# EAGLE design PCB Plates Combined Eagle (EAGLE 9.6.2)
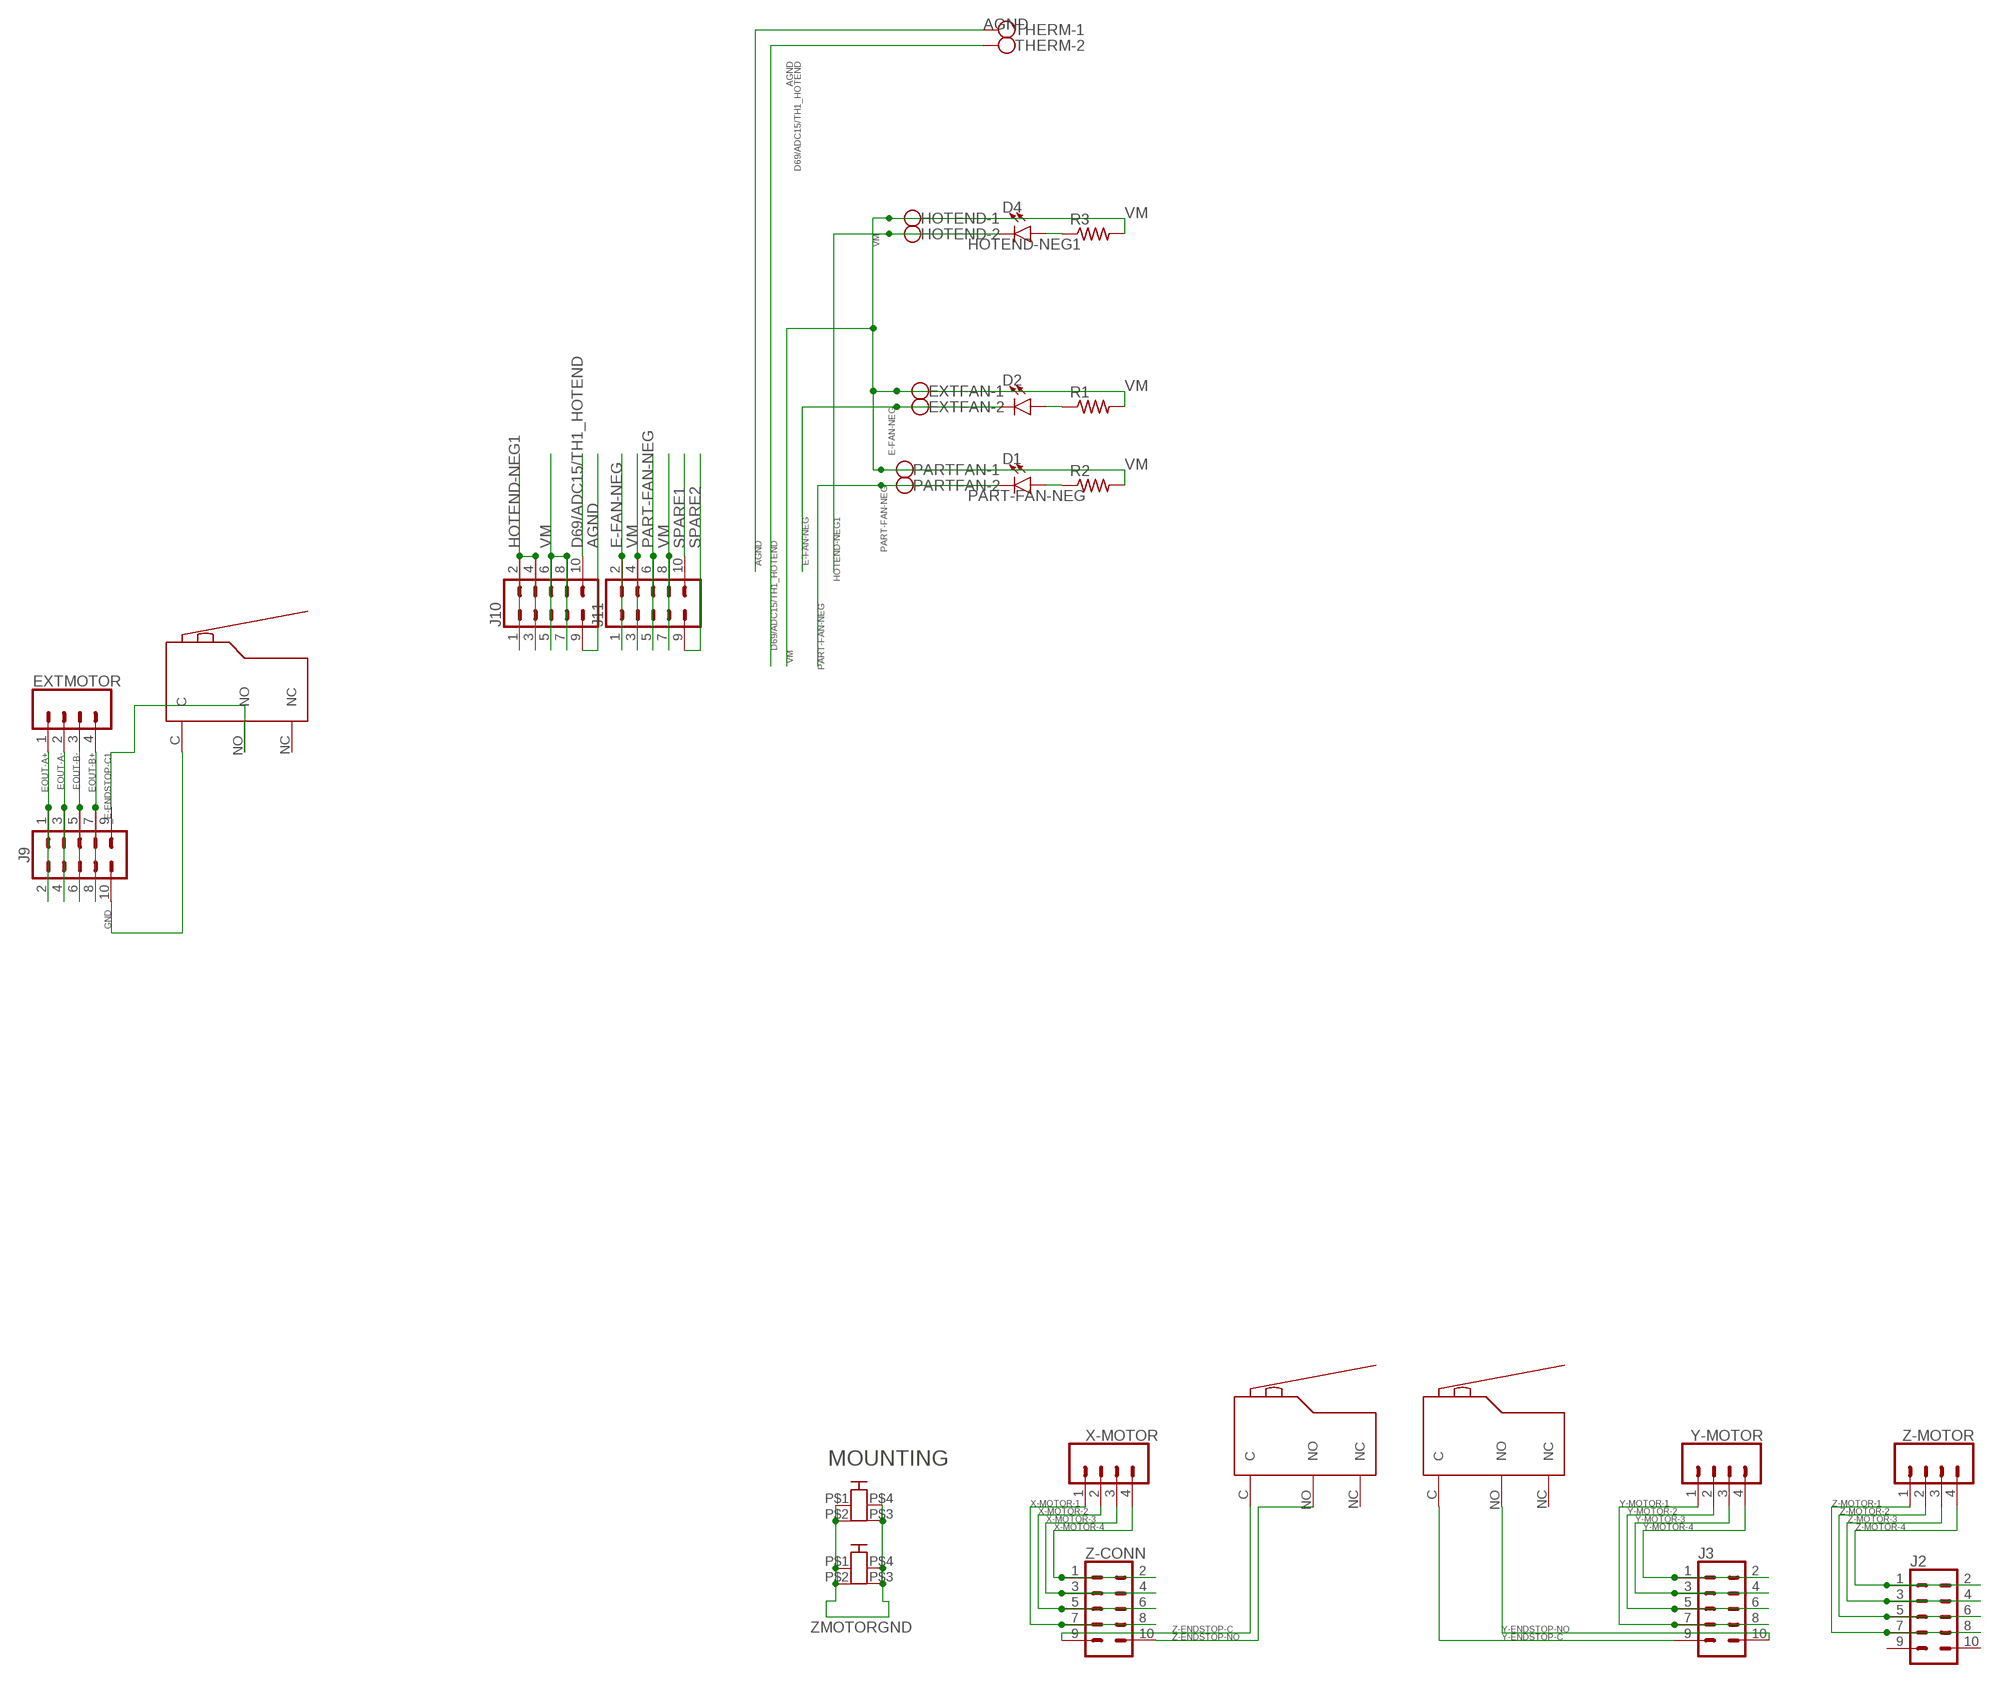
[diagram p0: schematic, sheet 1]

## Parts
CON1  PCB-2M3  [PCB2-M3]
CON7  PCB-2M3  [PCB2-M3]
D1  LED-FKIT-1206  [FKIT-LED-1206]
D2  LED-FKIT-1206  [FKIT-LED-1206]
D4  LED-FKIT-1206  [FKIT-LED-1206]
EXTFAN  W237-102  [W237-102]
EXTMOTOR  CONN_04SCREW_LOCK  [SCREWTERMINAL-3.5MM-4_LOCK]
HOTEND  W237-102  [W237-102]
J2  CONN_05X2SHD_LOCK  [2X5-SHROUDED_LOCK]
J3  CONN_05X2SHD_LOCK  [2X5-SHROUDED_LOCK]
J9  CONN_05X2SHD_LOCK  [2X5-SHROUDED_LOCK]
J10  CONN_05X2SHD_LOCK  [2X5-SHROUDED_LOCK]
J11  CONN_05X2SHD_LOCK  [2X5-SHROUDED_LOCK]
PARTFAN  W237-102  [W237-102]
R1  R-US_R1206  [R1206]
R2  R-US_R1206  [R1206]
R3  R-US_R1206  [R1206]
THERM  W237-102  [W237-102]
U$1  Lever Microswitch Leftangle PCB mount, with Roller style lever, with a red roller  LEVERMICROPCBLEFTANGLE  [LEVERMICROPCB-LEFTANGLE]
X-MOTOR  CONN_04SCREW_LOCK  [SCREWTERMINAL-3.5MM-4_LOCK]
XENDSTOP  Lever Microswitch Leftangle PCB mount, with Roller style lever, with a red roller  LEVERMICROPCBLEFTANGLE  [LEVERMICROPCB-LEFTANGLE]
Y-MOTOR  CONN_04SCREW_LOCK  [SCREWTERMINAL-3.5MM-4_LOCK]
Z-CONN  CONN_05X2SHD_LOCK  [2X5-SHROUDED_LOCK]
Z-MOTOR  CONN_04SCREW_LOCK  [SCREWTERMINAL-3.5MM-4_LOCK]
ZENDSTOP  Lever Microswitch Leftangle PCB mount, with Roller style lever, with a red roller  LEVERMICROPCBLEFTANGLE  [LEVERMICROPCB-LEFTANGLE]

## Nets
_E-ENDSTOP-C1: J9.9 XENDSTOP.NO
AGND: J10.9 THERM.1
D69/ADC15/TH1_HOTEND: J10.10 THERM.2
E-FAN-NEG: D2.C EXTFAN.2 J11.1 J11.2
EOUT-A+: EXTMOTOR.1 J9.1 J9.2
EOUT-A-: EXTMOTOR.2 J9.3 J9.4
EOUT-B+: EXTMOTOR.4 J9.7 J9.8
EOUT-B-: EXTMOTOR.3 J9.5 J9.6
GND: J9.10 XENDSTOP.C
HOTEND-NEG1: D4.C HOTEND.2 J10.1 J10.2 J10.3 J10.4
N$12: D2.A R1.1
N$48: D1.A R2.1
N$49: D4.A R3.1
PART-FAN-NEG: D1.C J11.5 J11.6 PARTFAN.2
SPARE1: J11.10
SPARE2: J11.9
VM: EXTFAN.1 HOTEND.1 J10.5 J10.6 J10.7 J10.8 J11.3 J11.4 J11.7 J11.8 PARTFAN.1 R1.2 R2.2 R3.2
X-MOTOR-1: X-MOTOR.1 Z-CONN.7 Z-CONN.8
X-MOTOR-2: X-MOTOR.2 Z-CONN.5 Z-CONN.6
X-MOTOR-3: X-MOTOR.3 Z-CONN.3 Z-CONN.4
X-MOTOR-4: X-MOTOR.4 Z-CONN.1 Z-CONN.2
Y-ENDSTOP-C: J3.9 U$1.C
Y-ENDSTOP-NO: J3.10 U$1.NO
Y-MOTOR-1: J3.7 J3.8 Y-MOTOR.1
Y-MOTOR-2: J3.5 J3.6 Y-MOTOR.2
Y-MOTOR-3: J3.3 J3.4 Y-MOTOR.3
Y-MOTOR-4: J3.1 J3.2 Y-MOTOR.4
Z-ENDSTOP-C: Z-CONN.9 ZENDSTOP.C
Z-ENDSTOP-NO: Z-CONN.10 ZENDSTOP.NO
Z-MOTOR-1: J2.7 J2.8 Z-MOTOR.1
Z-MOTOR-2: J2.5 J2.6 Z-MOTOR.2
Z-MOTOR-3: J2.3 J2.4 Z-MOTOR.3
Z-MOTOR-4: J2.1 J2.2 Z-MOTOR.4
ZMOTORGND: CON1.P$1 CON1.P$2 CON1.P$3 CON1.P$4 CON7.P$1 CON7.P$2 CON7.P$3 CON7.P$4
Unconnected: J2.9 J2.10 U$1.NC XENDSTOP.NC ZENDSTOP.NC

## Notes on the sheet
- MOUNTING

## Library data of the parts
CON1 CON7 = Screw Terminals:PCB-2M3
D1 D2 D4 = SparkFun-LED:LED: LED (Generic) Standard schematic elements and footprints for 5mm, 3mm, 1206, and 0603 sized LEDs. Generic LEDs with no color specified.
EXTFAN HOTEND PARTFAN THERM = con-wago-500:W237-102: WAGO SCREW CLAMP; MPN: 237-102; OC_FARNELL: unknown; OC_NEWARK: 70K9898
EXTMOTOR X-MOTOR Y-MOTOR Z-MOTOR = SparkFun-Connectors:CONN_04: Multi connection point. Often used as Generic Header-pin footprint for 0.1 inch spaced/style header connections On any of the 0.1 inch spaced packages, you can populate with these: Break Away Headers - Straight (PRT-00116) Break Away Male Headers - Right Angle (PRT-00553) Female Headers (PRT-00115) Break Away Headers - Machine Pin (PRT-00117) Break Away Female Headers - Swiss Machine Pin (PRT-00743) For SCREWTERMINALS and SPRING TERMINALS visit here: Screw Terimnals on SparkFun.com (5mm/3.5mm/2.54mm spacing) This device is also useful as a general connection point to wire up your design to another part of your project. Our various solder wires solder well into these plated through hole pads. Hook-Up Wire - Assortment (Stranded, 22 AWG) (PRT-11375) Hook-Up Wire - Assortment (Solid Core, 22 AWG) (PRT-11367) View the entire wire category on our website here Special notes: Molex polarized connector foot print use with SKU : PRT-08231 with associated crimp pins and housings. 1MM SMD Version SKU: PRT-10208
J2 J3 J9-J11 Z-CONN = SparkFun-Connectors:CONN_05X2: Multi connection point. Often used as Generic Header-pin footprint for 0.1 inch spaced/style header connections For AVR SPI programming port, see special device with nice symbol: "AVR_SPI_PROG_5x2.dev" You can populate with any combo of single row headers, but if you'd like an exact match, check these: 2x5 AVR ICSP Male Header (PRT-00778) 2x5 Pin Shrouded Header (PRT-08506) On any of the 0.1 inch spaced packages, you can populate with these: Break Away Headers - Straight (PRT-00116) Break Away Male Headers - Right Angle (PRT-00553) Female Headers (PRT-00115) Break Away Headers - Machine Pin (PRT-00117) Break Away Female Headers - Swiss Machine Pin (PRT-00743) Special note: the shrouded connector mates well with our 5x2 ribbon cables: 2x5 Pin IDC Ribbon Cable (PRT-08535); PROD_ID: CONN-08671; SF_ID: PRT-08506
R1-R3 = rcl:R-US_: RESISTOR, American symbol; SPICEPREFIX: R
U$1 XENDSTOP ZENDSTOP = Lever Microswitch Right Angle:LEVERMICROPCB

## Net classes
0 default: width 0.203 mm, clearance 0.152 mm

## Board
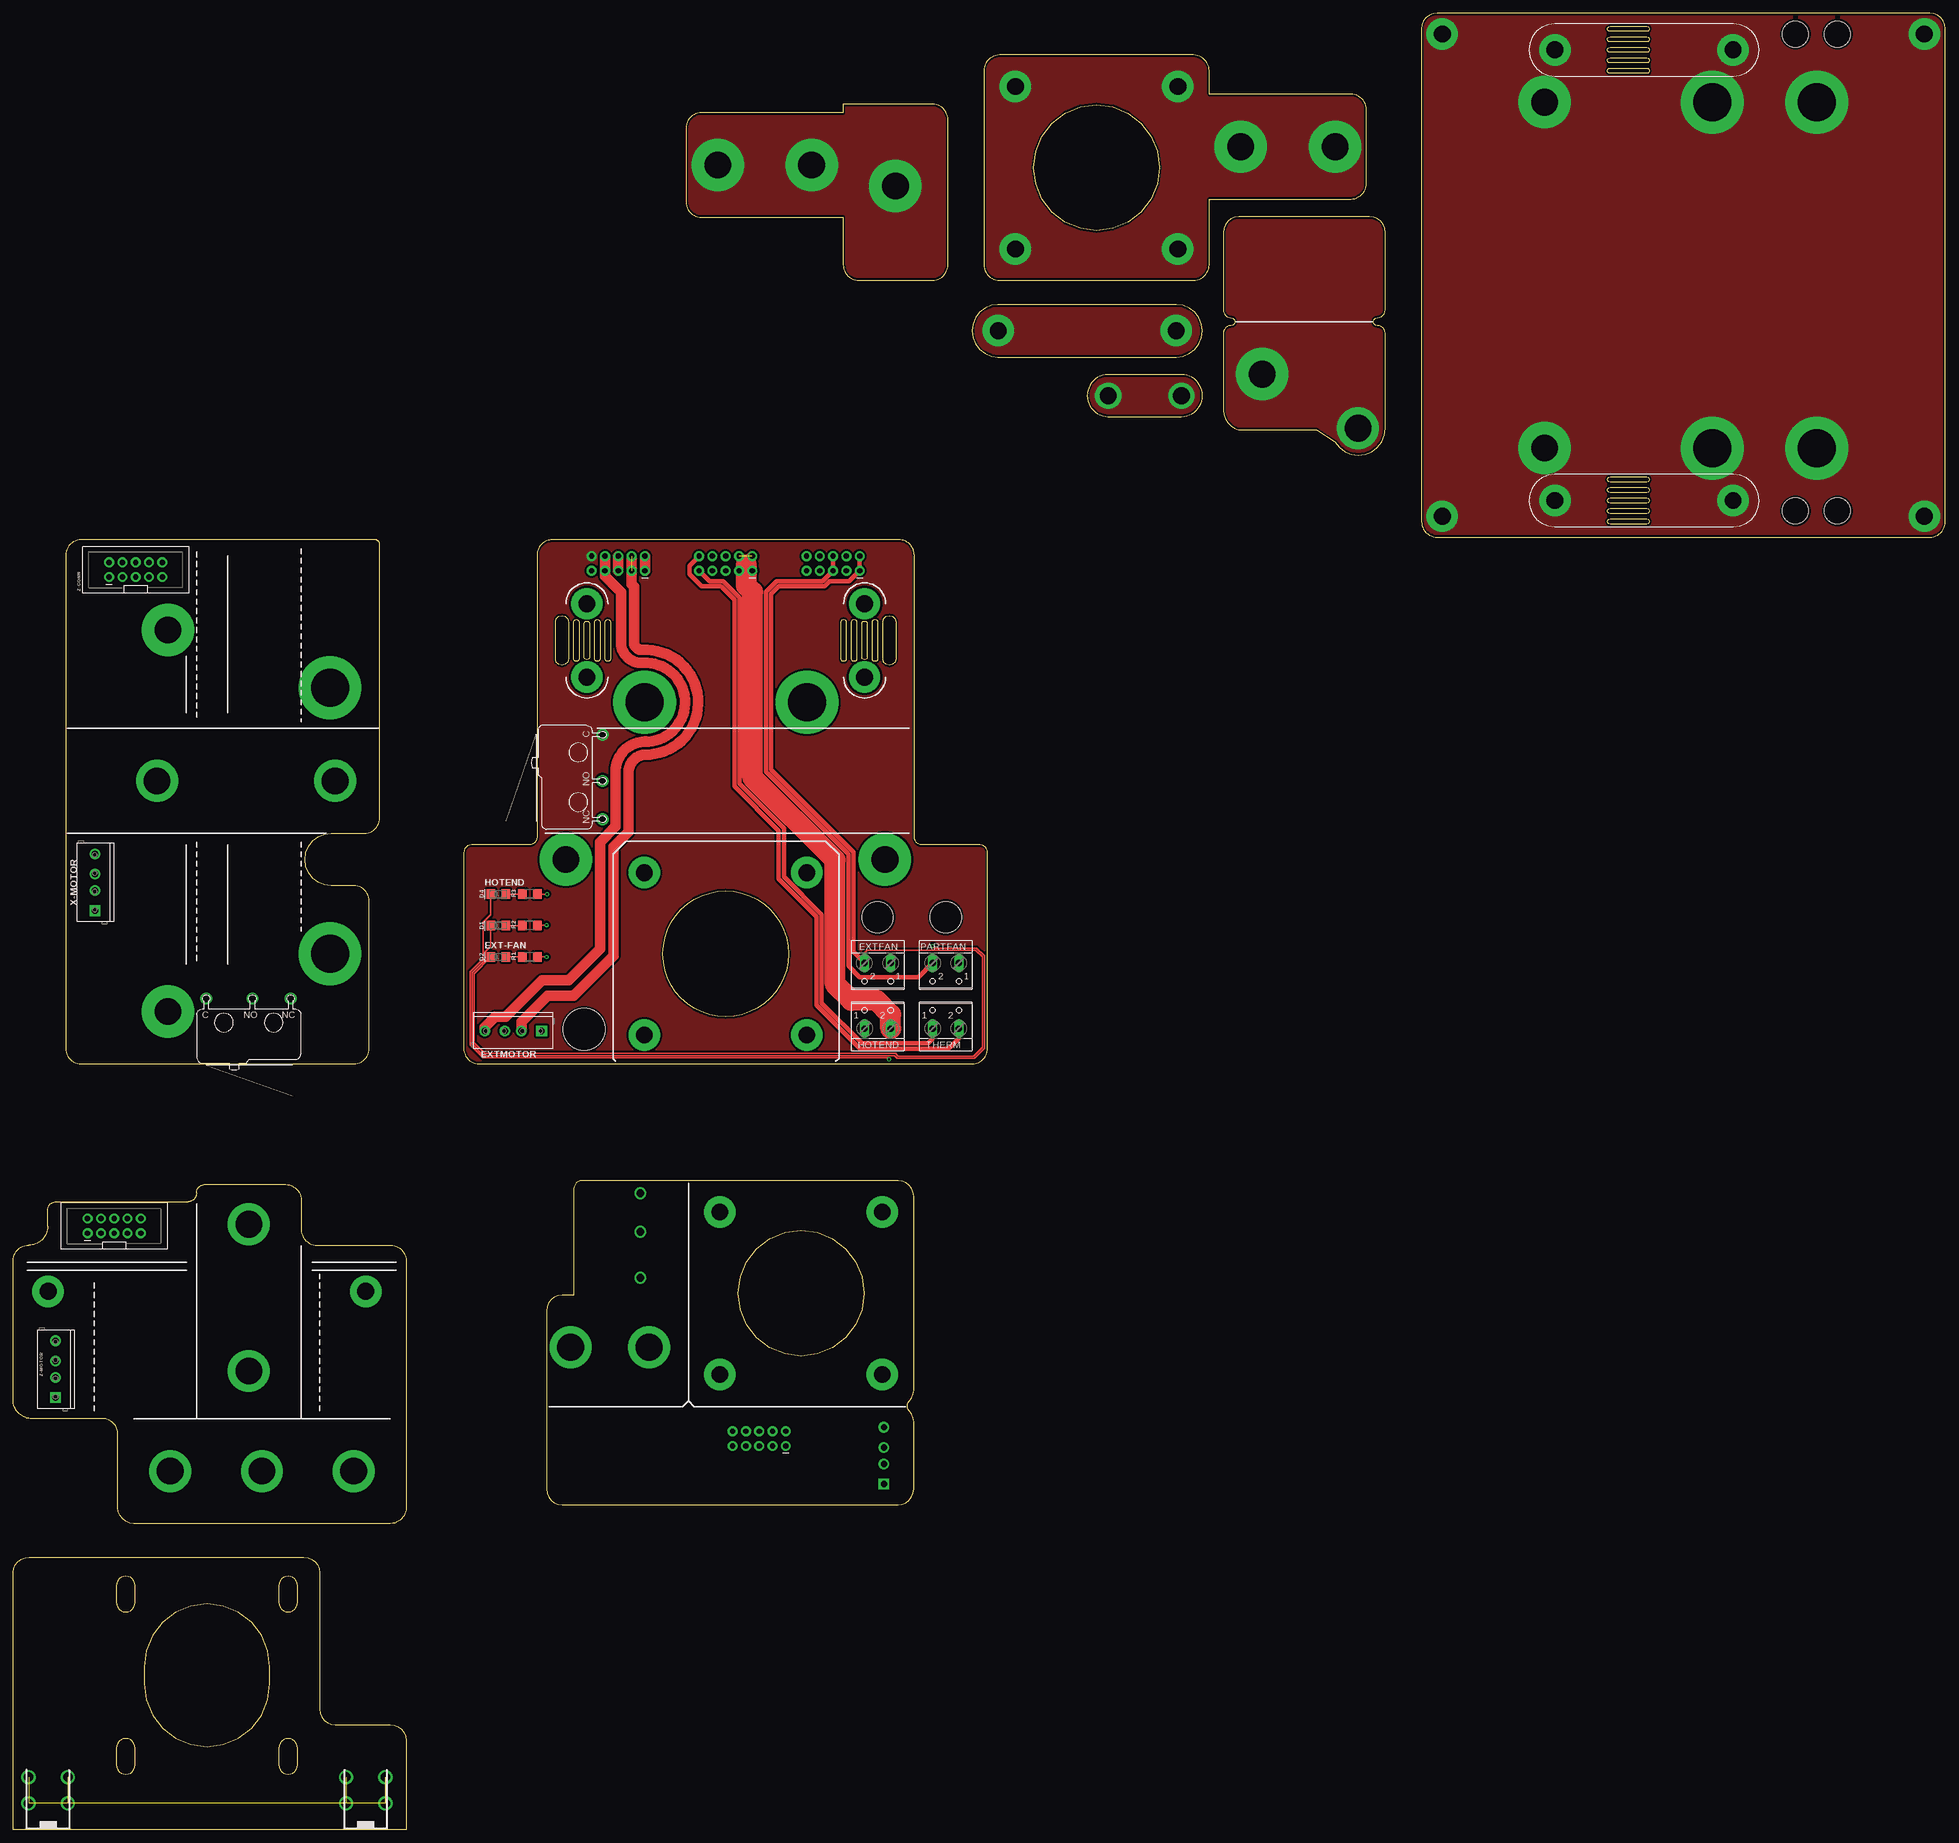
[diagram p1: board, top side]
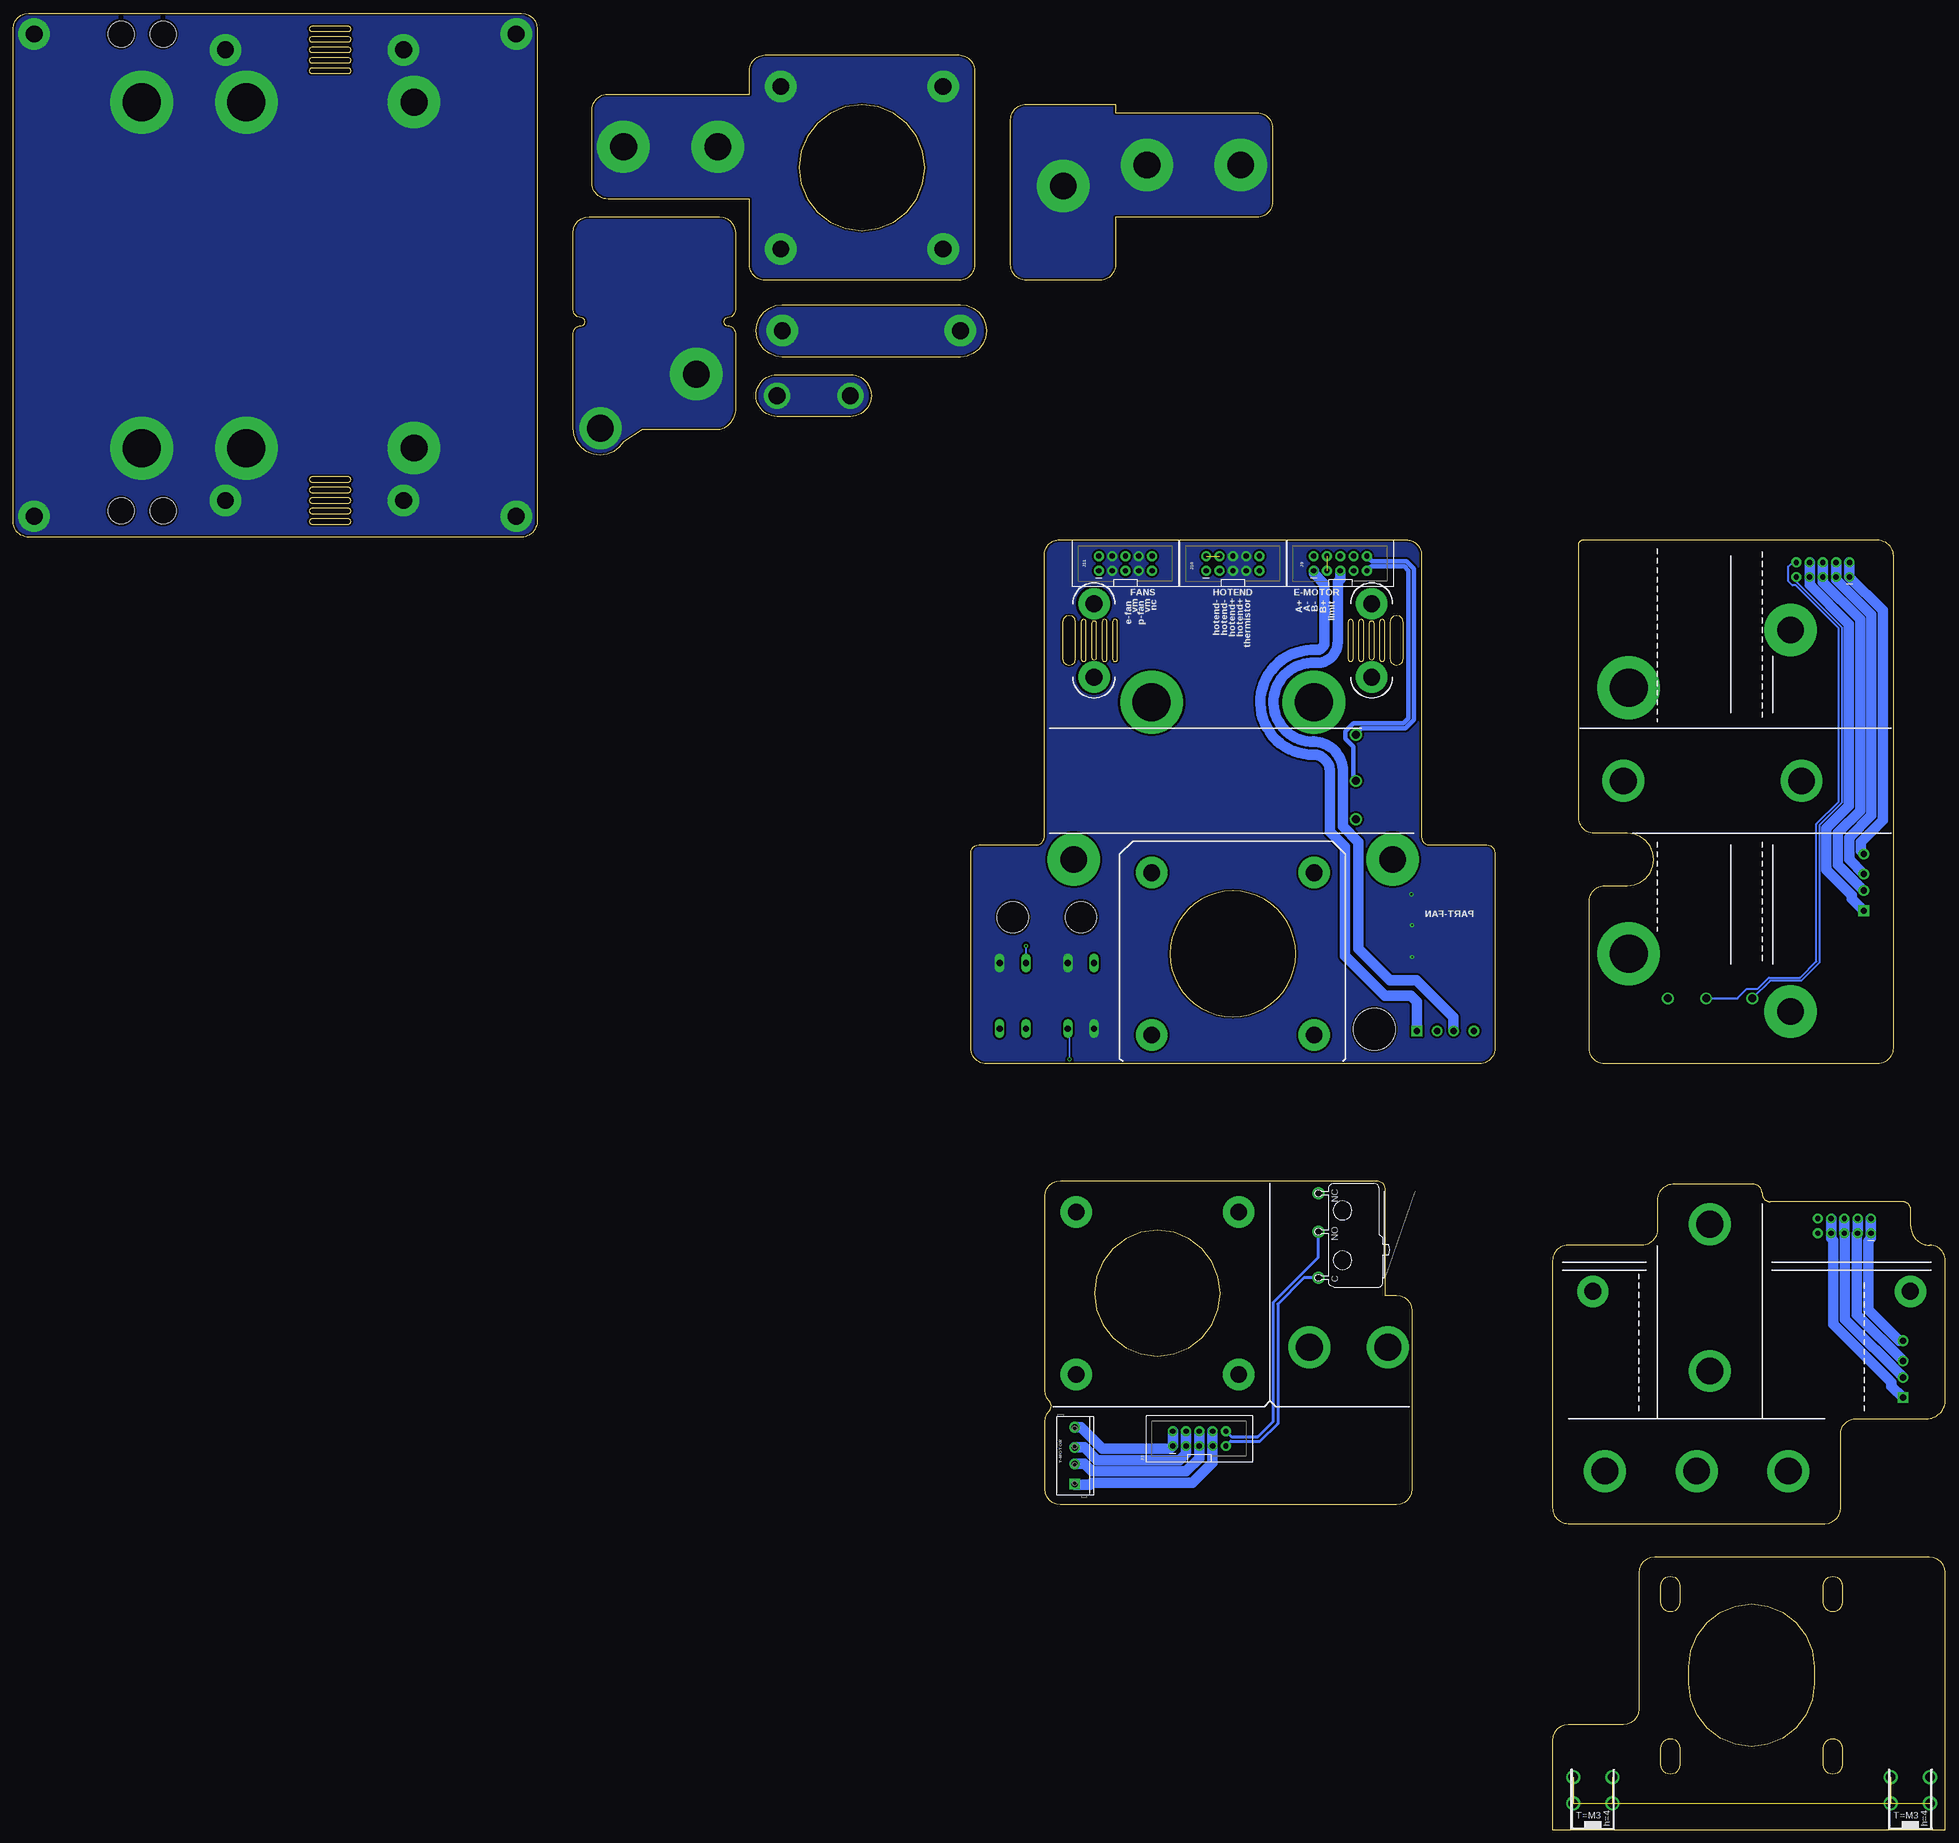
[diagram p2: board, bottom side, seen from below]

Size 368.8 x 346.6 mm. Coordinates in mm from the lower left corner, seen from the top.
Outline: 1141 segments
Copper layers (1*16): Top 0.035mm / dielectric 1.5mm / Bottom 0.035mm
Design rules "default *": minimum track width 6mil, minimum drill 0.35mm, track to track 6mil, track to pad 6mil, pad to pad 6mil, via to via 6mil, smd to smd 6mil, copper to edge 10mil, drill to drill 6mil, minimum pad ring 10mil, minimum via ring 8mil, stop-mask expansion 4mil, vias tented up to drill 0mil, thermal gap 10mil
Holes 6 mm at 178,174.1 165,174.1
Holes 8 mm at 109,152.7
Holes 5 mm at 340.17,342.6 348.17,342.6 340.17,251.6 348.17,251.6

### Footprints (pad centres in the part's own frame; a part is rotated, then mirrored left to right if it is on the bottom)
PCB2-M3 = drill 1.8: P$1 -3.75,-5; P$2 3.75,-5; P$3 3.75,-10; P$4 -3.75,-10
FKIT-LED-1206 = smd 1.6 x 1.803: A -1.422,0; C 1.422,0
W237-102 = drill 1.194 long: 1 -2.5,-1.27; 2 2.5,-1.27
SCREWTERMINAL-3.5MM-4_LOCK = drill 1.2 pad 2.032 square: 1 -0.178,0 | drill 1.2 pad 2.032: 2 3.678,0; 3 6.822,0; 4 10.678,0
2X5-SHROUDED_LOCK = drill 1.016 pad 1.88: 1 -1.397,5.08; 2 1.397,5.08; 3 -1.397,2.54; 4 1.397,2.54; 5 -1.397,0; 6 1.397,0; 7 -1.397,-2.54; 8 1.397,-2.54; 9 -1.397,-5.08; 10 1.397,-5.08
R1206 = smd 1.6 x 1.803: 1 -1.422,0; 2 1.422,0
LEVERMICROPCB-LEFTANGLE = drill 1.5: C 7.3,-7.1; NC -8.8,-7.1; NO -1.5,-7.1

### Placement (x,y rotation side)
CON1  67.3,0 180 bottom
CON7  6.7,0 180 bottom
D1  92.6,172.5 180 top
D2  92.6,166.5 180 top
D4  92.6,178.5 180 top
EXTFAN  165,164.1 180 top
EXTMOTOR  100.7,152.4 180 top
HOTEND  165,154.1 0 top
J2  19.3,115.2 90 top
J3  142.4,74.6 90 bottom
J9  115.5,241.6 90 bottom
J10  136,241.6 90 bottom
J11  156.5,241.6 90 bottom
PARTFAN  178,164.1 180 top
R1  98.6,166.5 0 top
R2  98.6,172.5 0 top
R3  98.6,178.5 0 top
THERM  178,154.1 0 top
U$1  112.6,112.6 270 bottom
X-MOTOR  15.6,175.5 90 top
XENDSTOP  105.4,201.6 90 top
Y-MOTOR  166.2,66.1 90 bottom
Z-CONN  23.4,240.4 90 top
Z-MOTOR  8.1,82.6 90 top
ZENDSTOP  44.17,151.5 180 top

### Tracks (layer width: path | path; a pad name or v marks a point on that pad's centre or on a via)
_E-ENDSTOP-C1
  Bottom 0.813: XENDSTOP.NO 113,200.6 113,206.6 114.5,208.1 114.5,209.6 113,211.1 103.5,211.1 102.5,212.1 102.5,240.24 103.3,241.03 109.59,241.03 J9.9
AGND
  Top 0.813: J10.9 132.92,238.2 135.48,238.2 138.62,235.06 138.62,199.58 147.1,191.1 147.1,181.8 154.32,174.58 154.32,157.68 162,150 174.57,150 175.5,150.93 THERM.1
BELTCLAMP1  (via drill 3.2 pad 5)
  other vias: 209,273.6 223,273.6
  pour Top (isolate 0.406): 208.5,269.7 223,269.7 arc182 223,277.6 208.5,277.6 arc163
  pour Bottom (isolate 0.406): 208.5,269.7 223,269.7 arc182 223,277.6 208.5,277.6 arc163
BELTCLAMP2  (via drill 3.2 pad 6)
  other vias: 222,286 188,286
  pour Top (isolate 0.406): 188,281 221.9,281 arc184 221.9,291 188,291 arc178
  pour Bottom (isolate 0.406): 188.1,281 222,281 arc184 222,291 188.1,291 arc178
D69/ADC15/TH1_HOTEND
  Top 0.813: J10.10 129.1,241.18 129.1,239.5 131.37,237.24 135.08,237.24 137.65,234.66 137.65,199.08 146.13,190.6 146.13,181.4 153.35,174.18 153.35,157.28 161.6,149.03 178.53,149.03 180.5,151 THERM.2
E-FAN-NEG
  Top 0.254: D2.C 88,163.32 88,150.1 90,148.1 168.38,148.1 168.87,147.61 183.33,147.61 184.99,149.27 184.99,166.53 183.72,167.8 163,167.8 162.5,167.3 EXTFAN.2
  Top 0.813: EXTFAN.2 160.4,167.47 160.4,186.5 144.7,202.2 144.7,235.83 146.1,237.24 154.9,237.24 155.86,238.2 159.58,238.2 J11.1 J11.2
EOUT-A+
  Top 2: J9.2 J9.1
  Bottom 2: EXTMOTOR.1 100.87,157.97 102,159.1 107,159.1 114.65,166.75 114.65,187.51 117.5,190.36 117.5,201.6 arc-90 120.35,205.1 120.5,205.1 arc180 121,225.1 120.03,225.1 arc-90 118.5,226.63 118.5,237.6 120.58,239.68 J9.1
EOUT-A-  (1 unrouted)
  Top 2: EXTMOTOR.2 97.02,154.12 102,159.1 107,159.1 114.65,166.75 114.65,187.51 117.5,190.36 117.5,201.6 arc-90 120.5,205.1 arc180 121,225.1 120,225.1 arc-90 118.5,226.6 118.5,237.1 118,237.6 118,240.16 J9.3 J9.4
EOUT-B+
  Top 2: EXTMOTOR.4 90,152.42 90,153.1 92,155.1 94,155.1 101,162.1 106,162.1 112,168.1 112,188.4 115,191.4 115,202.4 arc-90 121.2,207.6 120.5,207.6 arc180 121,222.6 120,222.6 arc-90 116,226.6 116,236.1 112.96,239.14 J9.7 J9.8
EOUT-B-
  Top 2: J9.6 J9.5
  Bottom 2: EXTMOTOR.3 93.87,154.97 101,162.1 106,162.1 112,168.1 112,188.4 115,191.4 115,202.4 arc-90 121.2,207.6 120.5,207.6 arc180 121,222.6 120,222.6 arc-90 116,226.6 116,238.1 115.5,238.6 J9.5
GND
  Bottom 0.813: J9.10 109.42,242 102.9,242 101.5,240.6 101.5,211.74 103.1,210.13 111.47,210.13 112.5,209.1 XENDSTOP.C
  pour Top (isolate 0.406, no thermals): 100,246.1 172,246.1 172,190.1 174,188.1 186,188.1 186,146.1 86,146.1 86,188.1 99,188.1 100,189.1
HOTEND-NEG1  (via drill 0.35)  (1 unrouted)
  Top 0.254: D4.C 91.18,174.6 89.69,173.11 89.69,166.16 87.19,163.66 87.19,149.76 89.66,147.29 166.91,147.29 v167.2,147
  Top 2: J10.4 140.32,241.22 140.32,240.96 J10.1 | J10.2 139.9,241.82 139.9,241.3 139.64,241.3 J10.3
  Top 4: HOTEND.2 167.5,155.5 164.8,158.2 160,158.2 156.88,161.32 156.88,185.04 141.18,200.74 141.18,236.12 139.9,237.4 139.9,241.3
  Bottom 0.254: v167.2,147 167.2,152.53 HOTEND.2
N$12
  Top 0.254: D2.A R1.1
N$13  (via drill 5.1 pad 10)
  other vias: 29.57,228.9
N$14  (via drill 5.1 pad 8)
  other vias: 27.47,200.1
N$15  (via drill 7.25 pad 12)
  other vias: 60.47,217.9
N$16  (via drill 5.1 pad 8)
  other vias: 61.47,200.1
N$17  (via drill 7.25 pad 12)
  other vias: 60.47,167.1
N$19  (via drill 5.1 pad 10)
  other vias: 166.4,185.1
N$20  (via drill 3.2 pad 6)
  other vias: 151.5,151.6
N$21  (via drill 3.2 pad 6)
  other vias: 165.9,86.83
N$22  (via drill 3.2 pad 6)
  other vias: 120.5,151.6
N$23  (via drill 5.1 pad 10)
  other vias: 105.5,185.1
N$24  (via drill 3.2 pad 6)
  other vias: 120.5,182.6
N$25  (via drill 3.2 pad 6)
  other vias: 151.5,182.6
N$26  (via drill 7.25 pad 12)
  other vias: 120.5,215.1
N$27  (via drill 5.1 pad 8)
  other vias: 106.4,92.03
N$28  (via drill 5.1 pad 8)
  other vias: 121.4,92.03
N$29  (via drill 7.25 pad 12)
  other vias: 151.5,215.1
N$30  (via drill 3.2 pad 6)
  other vias: 134.9,86.83
N$31  (via drill 3.2 pad 6)
  other vias: 165.9,117.83
N$40  (via drill 5.1 pad 8)
  other vias: 64.99,68.4
N$41  (via drill 5.1 pad 8)
  other vias: 29.99,68.4
N$42  (via drill 5.1 pad 8)
  other vias: 47.49,68.4
N$43  (via drill 3.2 pad 6)
  other vias: 162.5,219.9
N$44  (via drill 3.2 pad 6)
  other vias: 162.5,233.9
N$45  (via drill 3.2 pad 6)
  other vias: 109.5,233.9
N$46  (via drill 3.2 pad 6)
  other vias: 109.5,219.9
N$47  (via drill 5.1 pad 8)
  other vias: 44.99,87.5
N$48
  Top 0.254: D1.A R2.1
N$49
  Top 0.254: D4.A R3.1
N$50  (via drill 3.2 pad 6)
  other vias: 67.29,102.7
N$51  (via drill 5.1 pad 8)
  other vias: 44.99,115.5
PART-FAN-NEG  (via drill 0.35)
  Top 0.254: D1.C 91.18,168.6 90.1,167.52 90.1,166 87.59,163.49 87.59,149.93 89.83,147.69 168.21,147.69 168.7,147.2 183.5,147.2 185.4,149.1 185.4,166.7 183.89,168.21 175.89,168.21 v175.5,168.6
  Top 0.813: PARTFAN.2 172.79,162.66 161.56,162.66 159.44,164.78 159.44,186.1 143.74,201.8 143.74,236.24 145.7,238.2 154.5,238.2 J11.5 J11.6
  Bottom 0.254: v175.5,168.6 PARTFAN.2
VM  (via drill 0.35)
  Top 0.254: R3.2 v101.9,178.5 | R2.2 100.12,172.6 v101.8,172.6 | R1.2 v101.8,166.5
  pour Bottom (isolate 0.406, no thermals): 100,246.1 172,246.1 172,190.1 174,188.1 186,188.1 186,146.1 86,146.1 86,188.1 99,188.1 100,189.1
X-MOTOR-1
  Bottom 2: Z-CONN.8 Z-CONN.7 25.94,237.49 18.46,230.01 18.46,195.34 22.7,191.09 22.7,183.13 17.9,178.32 17.9,177.62 X-MOTOR.1
X-MOTOR-2
  Bottom 2: Z-CONN.6 Z-CONN.5 23.4,238 16.31,230.9 16.31,194.44 20.55,190.19 20.55,184.13 X-MOTOR.2
X-MOTOR-3
  Bottom 2: Z-CONN.4 Z-CONN.3 20.86,238.5 14.15,231.79 14.15,193.55 18.4,189.3 18.4,185.12 X-MOTOR.3
X-MOTOR-4
  Bottom 2: Z-CONN.2 Z-CONN.1 12,232.68 12,192.58 16.2,188.38 16.2,186.78 X-MOTOR.4
XIDLERGND  (via drill 5.1 pad 10)
  other vias: 134.5,317.6 152.4,317.6 168.4,313.6
  pour Top (isolate 0.406): 128.4,325.2 130.8,327.6 158.3,327.6 158.5,327.8 158.5,329 176.6,329 178.3,327.3 178.3,297 176.9,295.6 160.3,295.6 158.3,297.6 158.3,307.2 158.1,307.4 130.7,307.4 128.4,309.7
  pour Bottom (isolate 0.406): 128.4,325.2 130.8,327.6 158.3,327.6 158.5,327.8 158.5,329 176.6,329 178.3,327.3 178.3,297 176.9,295.6 160.3,295.6 158.3,297.6 158.3,307.2 158.1,307.4 130.7,307.4 128.4,309.7
XMOTORGND  (via drill 3.2 pad 6, 5.1 pad 10)
  other vias: 191.3,332.6 222.3,332.6 191.3,301.6 222.3,301.6 234.3,321.1 252.3,321.1
  pour Top (isolate 0.406): 185.4,297.4 185.4,336.7 187.1,338.4 226.4,338.4 228.3,336.5 228.3,331.5 228.6,331.2 256.6,331.2 258.3,329.5 258.3,312.7 256.8,311.2 228.8,311.2 228.3,310.7 228.3,297.6 226.4,295.7 187.1,295.7
  pour Bottom (isolate 0.406): 185.1,297.5 185.1,336.8 186.8,338.5 226.1,338.5 228,336.6 228,331.6 228.3,331.3 256.3,331.3 258,329.6 258,312.8 256.5,311.3 228.5,311.3 228,310.8 228,297.7 226.1,295.8 186.8,295.8
Y-ENDSTOP-C
  Bottom 0.61: U$1.C 122.4,105.3 127.44,100.26 127.44,77.46 130.8,74.1 136.42,74.1 J3.9
Y-ENDSTOP-NO
  Bottom 0.61: J3.10 136.32,75 131.22,75 128.3,77.92 128.3,100.6 119.7,109.2 U$1.NO
Y-MOTOR-1
  Bottom 2: Y-MOTOR.1 166.1,65.82 163.28,65.82 162.91,66.19 143.7,66.19 139.86,70.04 J3.7 J3.8
Y-MOTOR-2
  Bottom 2: Y-MOTOR.2 164.3,69.78 162.87,68.35 144.95,68.35 142.4,70.9 J3.5 J3.6
Y-MOTOR-3
  Bottom 2: Y-MOTOR.3 164.32,72.92 161.9,70.5 146.2,70.5 144.94,71.76 J3.3 J3.4
Y-MOTOR-4
  Bottom 2: Y-MOTOR.4 165.03,76.78 160.91,72.65 148.03,72.65 J3.1 J3.2
YCARGND  (via drill 3.2 pad 6, 5.1 pad 10, 7.25 pad 12)
  other vias: 328.27,339.6 294.27,339.6 292.27,329.6 344.27,329.6 292.27,263.6 344.27,263.6 328.27,253.6 294.27,253.6 272.77,250.6 364.77,250.6 364.77,342.6 272.77,342.6 324.27,329.6 324.27,263.6
  pour Top (isolate 0.406): 269.17,344.6 271.17,346.6 367.17,346.6 369.17,344.6 369.17,248.6 367.17,246.6 271.17,246.6 269.17,248.6
  pour Bottom (isolate 0.406): 269.17,344.6 271.17,346.6 367.17,346.6 369.17,344.6 369.17,248.6 367.17,246.6 271.17,246.6 269.17,248.6
YIDLERGND  (via drill 5.1 pad 10, 5.1 pad 8)
  other vias: 238.4,277.7 256.7,267.4
  pour Top (isolate 0.406): 231,305.5 231,269.4 233.4,267 249.6,267 254.1,262.5 259.8,262.5 262,264.7 262,305.9 260.1,307.8 233.3,307.8
  pour Bottom (isolate 0.406): 230.9,305.6 230.9,269.5 233.3,267.1 249.5,267.1 254,262.6 259.7,262.6 261.9,264.8 261.9,306 260,307.9 233.2,307.9
YMOTORGND  (via drill 3.2 pad 6)
  other vias: 134.9,117.83
Z-ENDSTOP-C
  Bottom 0.406: Z-CONN.9 28.48,238.11 19.81,229.45 19.81,195.9 24.06,191.66 24.06,165.44 27.5,162 33.47,162 ZENDSTOP.C
Z-ENDSTOP-NO
  Bottom 0.406: ZENDSTOP.NO 39.7,158.6 37.9,160.4 35.86,160.4 33.7,162.56 27.73,162.56 24.62,165.67 24.62,191.89 20.37,196.14 20.37,229.21 28.56,237.4 29.2,237.4 30,238.2 30,240.98 29.18,241.8 Z-CONN.10
Z-MOTOR-1
  Bottom 2: J2.8 J2.7 21.84,112.8 21.44,112.4 21.44,96.46 10.3,85.32 10.3,84.62 Z-MOTOR.1
Z-MOTOR-2
  Bottom 2: J2.6 J2.5 19.2,113.7 19.2,97.38 Z-MOTOR.2
Z-MOTOR-3
  Bottom 2: J2.4 J2.3 16.96,113.6 16.96,98.28 Z-MOTOR.3
Z-MOTOR-4
  Bottom 2: J2.2 J2.1 14.22,112.8 14.72,112.3 14.72,99.22 8.78,93.28 Z-MOTOR.4
ZCARGND  (via drill 5.1 pad 10)
  other vias: 29.57,156.1
ZMOTORGND  (7 unrouted)
ZTEEGND  (via drill 3.2 pad 6)
  other vias: 6.69,102.7

### Text on the board
tPlace: HOTEND | EXT-FAN
bPlace: E-MOTOR | HOTEND | FANS | nc | vm | vm | B+ | B- | A- | A+ | limit | p-fan | e-fan | hotend+ | hotend+ | hotend- | hotend- | thermistor | PART-FAN